# Altium schematic sheet TDII_Bloques_R00.SchDoc
size A4
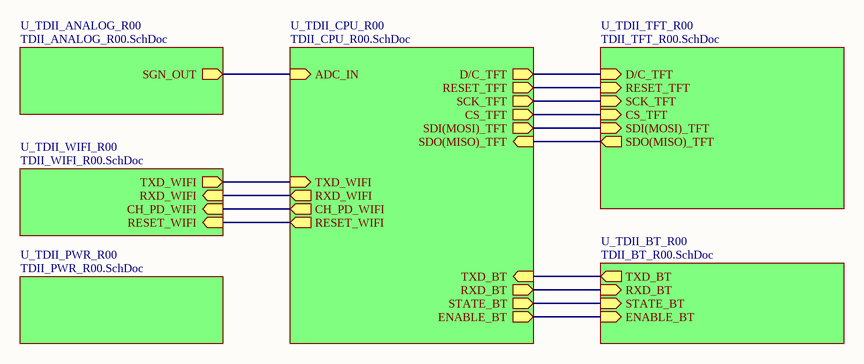
[diagram p0: TDII_Bloques_R00.SchDoc]

## Sub-sheets
U_TDII_ANALOG_R00 = TDII_ANALOG_R00.SchDoc: SGN_OUT (out)
U_TDII_BT_R00 = TDII_BT_R00.SchDoc: STATE_BT (in), RXD_BT (in), TXD_BT (out), ENABLE_BT (in)
U_TDII_CPU_R00 = TDII_CPU_R00.SchDoc: SCK_TFT (out), D/C_TFT (out), RESET_TFT (out), CS_TFT (out), SDO(MISO)_TFT (in), SDI(MOSI)_TFT (out), TXD_WIFI (in), RXD_WIFI (out), CH_PD_WIFI (out), RESET_WIFI (out), STATE_BT (out), TXD_BT (in), RXD_BT (out), ENABLE_BT (out), ADC_IN (in)
U_TDII_PWR_R00 = TDII_PWR_R00.SchDoc: no entries
U_TDII_TFT_R00 = TDII_TFT_R00.SchDoc: D/C_TFT (in), RESET_TFT (in), SCK_TFT (in), CS_TFT (in), SDO(MISO)_TFT (out), SDI(MOSI)_TFT (in)
U_TDII_WIFI_R00 = TDII_WIFI_R00.SchDoc: RXD_WIFI (in), TXD_WIFI (out), CH_PD_WIFI (in), RESET_WIFI (in)

## Nets
(unnamed): sheet U_TDII_ANALOG_R00/SGN_OUT, sheet U_TDII_CPU_R00/ADC_IN
(unnamed): sheet U_TDII_BT_R00/STATE_BT, sheet U_TDII_CPU_R00/STATE_BT
(unnamed): sheet U_TDII_BT_R00/RXD_BT, sheet U_TDII_CPU_R00/RXD_BT
(unnamed): sheet U_TDII_BT_R00/TXD_BT, sheet U_TDII_CPU_R00/TXD_BT
(unnamed): sheet U_TDII_BT_R00/ENABLE_BT, sheet U_TDII_CPU_R00/ENABLE_BT
(unnamed): sheet U_TDII_TFT_R00/D/C_TFT, sheet U_TDII_CPU_R00/D/C_TFT
(unnamed): sheet U_TDII_TFT_R00/RESET_TFT, sheet U_TDII_CPU_R00/RESET_TFT
(unnamed): sheet U_TDII_TFT_R00/SCK_TFT, sheet U_TDII_CPU_R00/SCK_TFT
(unnamed): sheet U_TDII_TFT_R00/CS_TFT, sheet U_TDII_CPU_R00/CS_TFT
(unnamed): sheet U_TDII_TFT_R00/SDO(MISO)_TFT, sheet U_TDII_CPU_R00/SDO(MISO)_TFT
(unnamed): sheet U_TDII_TFT_R00/SDI(MOSI)_TFT, sheet U_TDII_CPU_R00/SDI(MOSI)_TFT
(unnamed): sheet U_TDII_WIFI_R00/RXD_WIFI, sheet U_TDII_CPU_R00/RXD_WIFI
(unnamed): sheet U_TDII_WIFI_R00/TXD_WIFI, sheet U_TDII_CPU_R00/TXD_WIFI
(unnamed): sheet U_TDII_WIFI_R00/CH_PD_WIFI, sheet U_TDII_CPU_R00/CH_PD_WIFI
(unnamed): sheet U_TDII_WIFI_R00/RESET_WIFI, sheet U_TDII_CPU_R00/RESET_WIFI